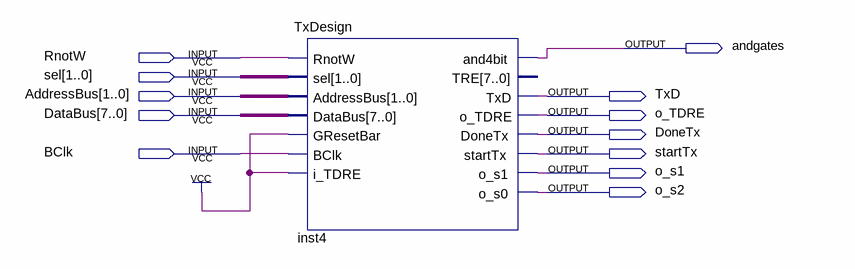
[diagram p0: schematic sheet]
// Quartus schematic testing_bus.bdf as structural Verilog: 1 symbols, 12 pins
module testing_bus (
  input  RnotW,
  input  [1:0] sel,
  input  [1:0] AddressBus,
  input  [7:0] DataBus,
  input  BClk,
  output andgates,
  output TxD,
  output o_TDRE,
  output DoneTx,
  output startTx,
  output o_s1,
  output o_s2
);

  TxDesign inst4 (
    .RnotW(RnotW), .sel(sel), .AddressBus(AddressBus), .DataBus(DataBus), .GResetBar(1'b1), .BClk(BClk),
    .i_TDRE(1'b1), .and4bit(andgates), .TxD(TxD), .o_TDRE(o_TDRE), .DoneTx(DoneTx), .startTx(startTx),
    .o_s1(o_s1), .o_s0(o_s2));  // open: TRE
endmodule
